# EAGLE schematic WiringDiagram (EAGLE 7.7.0)
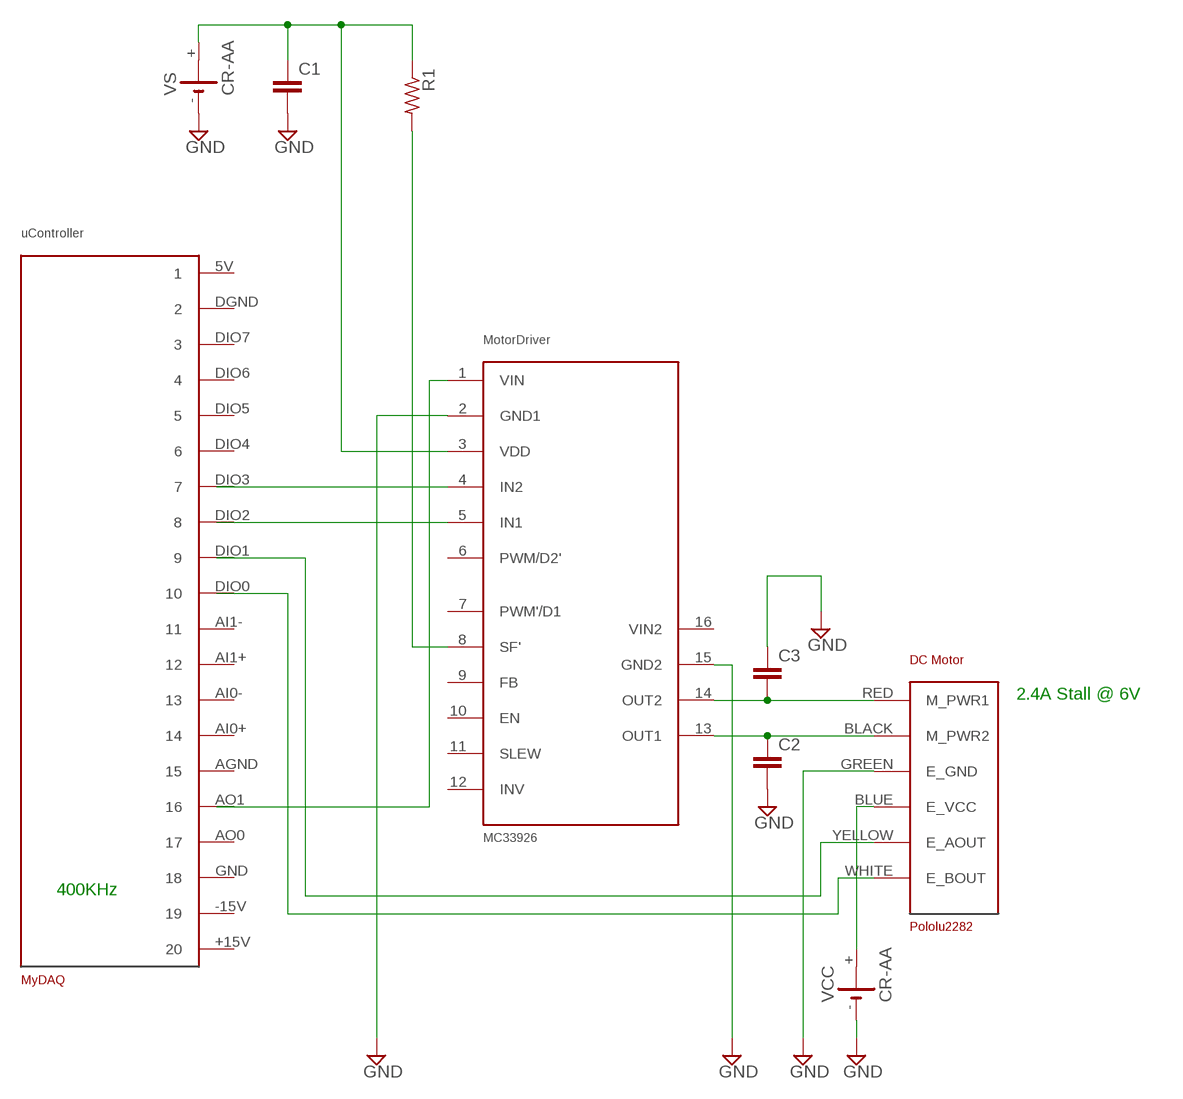
[diagram p0: schematic, sheet 1]

## Parts
C1  C2,5-3  [C2.5-3]
C2  C2,5-3  [C2.5-3]
C3  C2,5-3  [C2.5-3]
R1  R-US_0204/2V  [0204V]
U$1  MC33926  [MC33926]
U$2  DCMOTOR  [DCMOTOR]
U$3  MYDAQ  [MYDAQ]
VCC  CR-AA  [CRAA]
VS  CR-AA  [CRAA]

## Nets
GND: C1.2 C2.2 C3.1 U$1.2(GND1) U$1.15(GND2) U$2.GREEN(E_GND) VCC.- VS.-
N$1: C3.2 U$1.14(OUT2) U$2.RED(M_PWR1)
N$2: C2.1 U$1.13(OUT1) U$2.BLACK(M_PWR2)
N$3: C1.1 R1.1 U$1.3(VDD) VS.+
N$4: U$1.1(VIN)
N$5: R1.2 U$1.8(SF')
N$6: U$2.YELLOW(E_AOUT)
N$7: U$2.BLUE(E_VCC) VCC.+
N$8: U$1.5(IN1)
N$9: U$1.4(IN2)
N$10: U$2.WHITE(E_BOUT)
Unconnected: U$1.6(PWM/D2') U$1.7(PWM'/D1) U$1.9(FB) U$1.10(EN) U$1.11(SLEW) U$1.12(INV) U$1.16(VIN2) U$3.5V U$3.+15V U$3.-15V U$3.AGND U$3.AI0+ U$3.AI0- U$3.AI1+ U$3.AI1- U$3.AO0 U$3.AO1 U$3.DGND U$3.DIO0 U$3.DIO1 U$3.DIO2 U$3.DIO3 U$3.DIO4 U$3.DIO5 U$3.DIO6 U$3.DIO7 U$3.GND VCC.+@1(+) VS.+@1(+)

## Notes on the sheet
- 2.4A Stall @ 6V
- 400KHz

## Library data of the parts
C1-C3 = capacitor-wima:C: CAPACITOR naming: grid - package width
R1 = rcl:R-US_: RESISTOR, American symbol
U$1 = MotorDriverMC33926:MC33926
U$2 = MotorDriverMC33926:DCMOTOR
U$3 = MotorDriverMC33926:MYDAQ
VCC VS = battery:CR-AA: LI BATTERY Varta CRAA-SLF